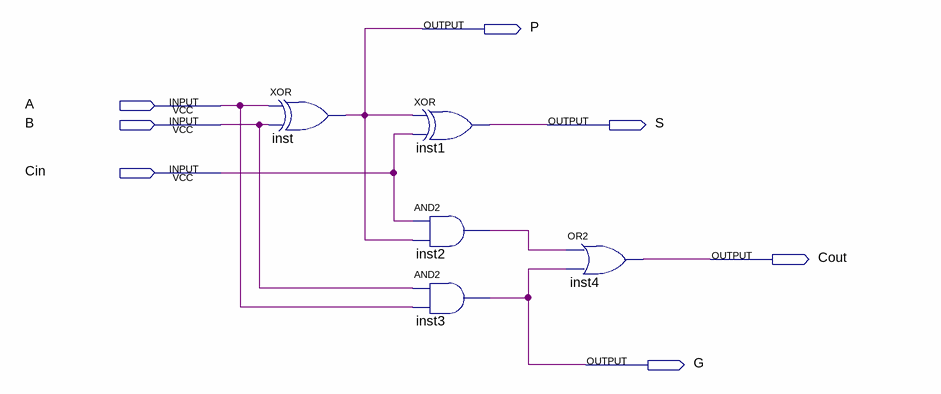
[diagram p0: schematic sheet]
// Quartus schematic Fa.bdf as structural Verilog: 5 symbols, 7 pins
module Fa (
  input  A,
  input  B,
  input  Cin,
  output P,
  output S,
  output Cout,
  output G
);

  wire inst2_out;

  xor inst (P, A, B);
  xor inst1 (S, P, Cin);
  and inst2 (inst2_out, Cin, P);
  and inst3 (G, B, A);
  or inst4 (Cout, inst2_out, G);
endmodule
